# EAGLE schematic TPS56528 (EAGLE 9.1.3)
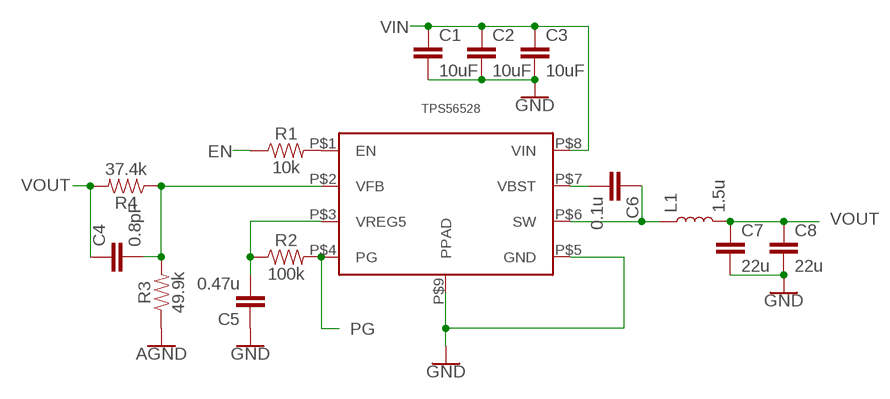
[diagram p0: schematic, sheet 1]

## Parts
C1  10uF  10UF-0805-10V-10%  [0805]
C2  10uF  10UF-0805-10V-10%  [0805]
C3  10uF  10UF-0805-10V-10%  [0805]
C4  0.8pF  0.8PF-0402-50V-0.1PF  [0402]
C5  0.47u  0.8PF-0402-50V-0.1PF  [0402]
C6  0.1u  0.8PF-0402-50V-0.1PF  [0402]
C7  22u  0.8PF-0402-50V-0.1PF  [0402]
C8  22u  0.8PF-0402-50V-0.1PF  [0402]
L1  1.5u  INDUCTOR-0402-3.9NH  [0402]
R1  10k  22OHM-0402-1/10W-1%  [0402]
R2  100k  22OHM-0402-1/10W-1%  [0402]
R3  49.9k  22OHM-0402-1/10W-1%  [0402]
R4  37.4k  22OHM-0402-1/10W-1%  [0402]
U$1  TPS56528  [DDA(8-POWERSOIC)]

## Nets
AGND: R3.1
EN: R1.1
GND: C1.2 C2.2 C3.2 C5.1 C7.2 C8.2 U$1.P$5(GND) U$1.P$9(PPAD)
N$4: C6.2 U$1.P$7(VBST)
N$5: C6.1 L1.1 U$1.P$6(SW)
N$8: C5.2 R2.1 U$1.P$3(VREG5)
N$10: C4.2 R3.2 R4.1 U$1.P$2(VFB)
N$14: R1.2 U$1.P$1(EN)
PG: R2.2 U$1.P$4(PG)
VIN: C1.1 C2.1 C3.1 U$1.P$8(VIN)
VOUT: C4.1 C7.1 C8.1 L1.2 R4.2

## Library data of the parts
C1-C3 = SparkFun-Capacitors:10UF: 10.0µF ceramic capacitors A capacitor is a passive two-terminal electrical component used to store electrical energy temporarily in an electric field.; PROD_ID: CAP-11330
C4 = SparkFun-Capacitors:0.8PF: 0.8pF ceramic capacitors A capacitor is a passive two-terminal electrical component used to store electrical energy temporarily in an electric field.; PROD_ID: CAP-13456
C5-C8 = SparkFun-Capacitors:0.8PF: 0.8pF ceramic capacitors A capacitor is a passive two-terminal electrical component used to store electrical energy temporarily in an electric field.; PROD_ID: CAP-13456; VALUE: 0.8pF
L1 = SparkFun-Coils:INDUCTOR: Inductors Resist changes in electrical current. Basically a coil of wire. SparkFun Products: SparkFun Load Cell Amplifier - HX711 <https://www.sparkfun.com/products/13879> IOIO-OTG - V2.2 <https://www.sparkfun.com/products/13613>; PROD_ID: NDUC-13457; VALUE: 3.9NH
R1-R4 = SparkFun-Resistors:22OHM: 22Ω resistor A resistor is a passive two-terminal electrical component that implements electrical resistance as a circuit element. Resistors act to reduce current flow, and, at the same time, act to lower voltage levels within circuits. - Wikipedia; PROD_ID: RES-12427; VALUE: 22
U$1 = power:TPS56528